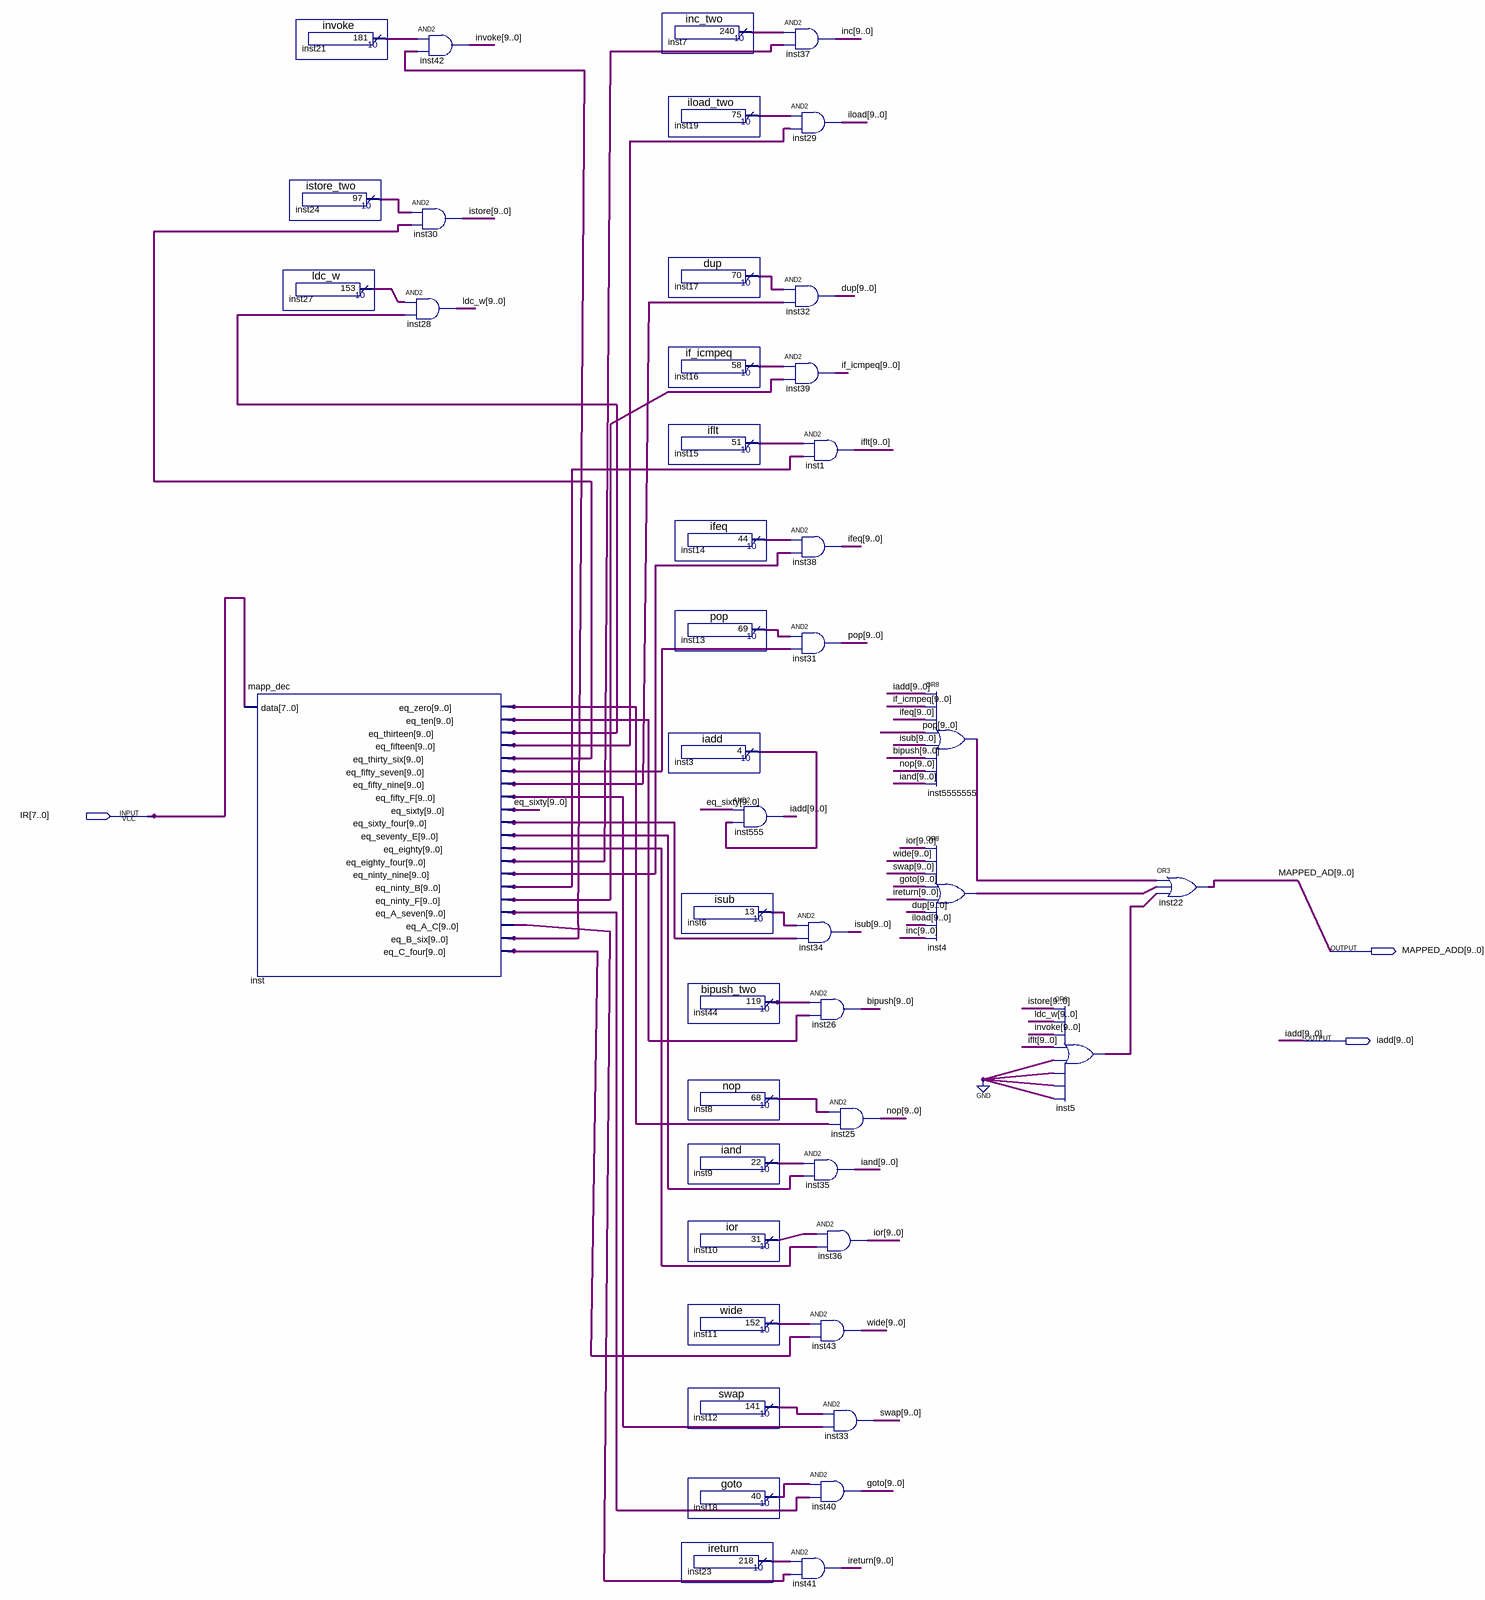
[diagram p0: schematic sheet]
// Quartus schematic mapping_instr_two.bdf as structural Verilog: 45 symbols, 3 pins
module mapping_instr_two (
  input  [7:0] IR,
  output [9:0] MAPPED_ADD,
  output [9:0] iadd
);

  wire [9:0] bipush, dup, eq_sixty, goto, iand, if_icmpeq, ifeq, iflt, iload, inc, inst3_result, inst4_out,
       inst5_out, inst6_result, inst7_result, inst8_result, inst9_result, inst10_result, inst11_result,
       inst12_result, inst13_result, inst14_result, inst15_result, inst16_result, inst17_result,
       inst18_result, inst19_result, inst21_result, inst23_result, inst24_result, inst27_result,
       inst44_result, inst5555555_out, inst_eq_a_c, inst_eq_a_seven, inst_eq_b_six, inst_eq_c_four,
       inst_eq_eighty, inst_eq_eighty_four, inst_eq_fifteen, inst_eq_fifty_f, inst_eq_fifty_nine,
       inst_eq_fifty_seven, inst_eq_ninty_b, inst_eq_ninty_f, inst_eq_ninty_nine, inst_eq_seventy_e,
       inst_eq_sixty_four, inst_eq_ten, inst_eq_thirteen, inst_eq_thirty_six, inst_eq_zero, invoke, ior,
       ireturn, istore, isub, ldc_w, nop, pop, swap, wide;

  mapp_dec inst (
    .data(IR), .eq_zero(inst_eq_zero), .eq_ten(inst_eq_ten), .eq_thirteen(inst_eq_thirteen),
    .eq_fifteen(inst_eq_fifteen), .eq_thirty_six(inst_eq_thirty_six), .eq_fifty_seven(inst_eq_fifty_seven),
    .eq_fifty_nine(inst_eq_fifty_nine), .eq_fifty_F(inst_eq_fifty_f), .eq_sixty(eq_sixty),
    .eq_sixty_four(inst_eq_sixty_four), .eq_seventy_E(inst_eq_seventy_e), .eq_eighty(inst_eq_eighty),
    .eq_eighty_four(inst_eq_eighty_four), .eq_ninty_nine(inst_eq_ninty_nine), .eq_ninty_B(inst_eq_ninty_b),
    .eq_ninty_F(inst_eq_ninty_f), .eq_A_seven(inst_eq_a_seven), .eq_A_C(inst_eq_a_c),
    .eq_B_six(inst_eq_b_six), .eq_C_four(inst_eq_c_four));
  invoke inst21 (.result(inst21_result));
  istore_two inst24 (.result(inst24_result));
  ldc_w inst27 (.result(inst27_result));
  assign istore = inst24_result & inst_eq_thirty_six;  // AND2 inst30, 10 bits wide
  assign ldc_w = inst27_result & inst_eq_thirteen;  // AND2 inst28, 10 bits wide
  assign invoke = inst21_result & inst_eq_b_six;  // AND2 inst42, 10 bits wide
  inc_two inst7 (.result(inst7_result));
  iload_two inst19 (.result(inst19_result));
  dup inst17 (.result(inst17_result));
  if_icmpeq inst16 (.result(inst16_result));
  iflt inst15 (.result(inst15_result));
  iadd inst3 (.result(inst3_result));
  ifeq inst14 (.result(inst14_result));
  pop inst13 (.result(inst13_result));
  isub inst6 (.result(inst6_result));
  bipush_two inst44 (.result(inst44_result));
  nop inst8 (.result(inst8_result));
  iand inst9 (.result(inst9_result));
  ior inst10 (.result(inst10_result));
  wide inst11 (.result(inst11_result));
  swap inst12 (.result(inst12_result));
  goto inst18 (.result(inst18_result));
  ireturn inst23 (.result(inst23_result));
  assign iadd = eq_sixty & inst3_result;  // AND2 inst555, 10 bits wide
  assign inc = inst7_result & inst_eq_eighty_four;  // AND2 inst37, 10 bits wide
  assign iload = inst19_result & inst_eq_fifteen;  // AND2 inst29, 10 bits wide
  assign dup = inst17_result & inst_eq_fifty_nine;  // AND2 inst32, 10 bits wide
  assign if_icmpeq = inst16_result & inst_eq_ninty_f;  // AND2 inst39, 10 bits wide
  assign iflt = inst15_result & inst_eq_ninty_b;  // AND2 inst1, 10 bits wide
  assign ifeq = inst14_result & inst_eq_ninty_nine;  // AND2 inst38, 10 bits wide
  assign pop = inst13_result & inst_eq_fifty_seven;  // AND2 inst31, 10 bits wide
  assign isub = inst6_result & inst_eq_sixty_four;  // AND2 inst34, 10 bits wide
  assign bipush = inst44_result & inst_eq_ten;  // AND2 inst26, 10 bits wide
  assign iand = inst9_result & inst_eq_seventy_e;  // AND2 inst35, 10 bits wide
  assign ior = inst10_result & inst_eq_eighty;  // AND2 inst36, 10 bits wide
  assign wide = inst11_result & inst_eq_c_four;  // AND2 inst43, 10 bits wide
  assign swap = inst12_result & inst_eq_fifty_f;  // AND2 inst33, 10 bits wide
  assign goto = inst18_result & inst_eq_a_seven;  // AND2 inst40, 10 bits wide
  assign ireturn = inst23_result & inst_eq_a_c;  // AND2 inst41, 10 bits wide
  assign nop = inst8_result & inst_eq_zero;  // AND2 inst25, 10 bits wide
  assign inst5555555_out = iadd | if_icmpeq | ifeq | pop | isub | bipush | nop | iand;  // OR8 inst5555555, 10 bits wide
  assign inst4_out = ior | wide | swap | goto | ireturn | dup | iload | inc;  // OR8 inst4, 10 bits wide
  assign inst5_out = istore | ldc_w | invoke | iflt | {10{1'b0}} | {10{1'b0}} | {10{1'b0}} | {10{1'b0}};  // OR8 inst5, 10 bits wide
  assign MAPPED_ADD = inst5555555_out | inst4_out | inst5_out;  // OR3 inst22, 10 bits wide

  // Other names for the same wires on the sheet: MAPPED_AD[9:0] = MAPPED_ADD
endmodule
